# Altium schematic sheet ARM_EURO_Platine3.SchDoc
size A4; PageSetup: Record=PageOptions|CenterHorizontal=True|CenterVertical=True|PrintScale=1.00|XCorrection=1.00|YCorrection=1.00|PrintKind=0|BorderSize=5000000|LeftOffset=0|BottomOffset=0|Orientation=2|PaperLength=1000|PaperWidth=1000|Scale=100|PaperSource=7|PrintQuality=-3|MediaType=1|DitherType=10|PrintScaleMode=1|PaperKind=A4|PaperIndex=9
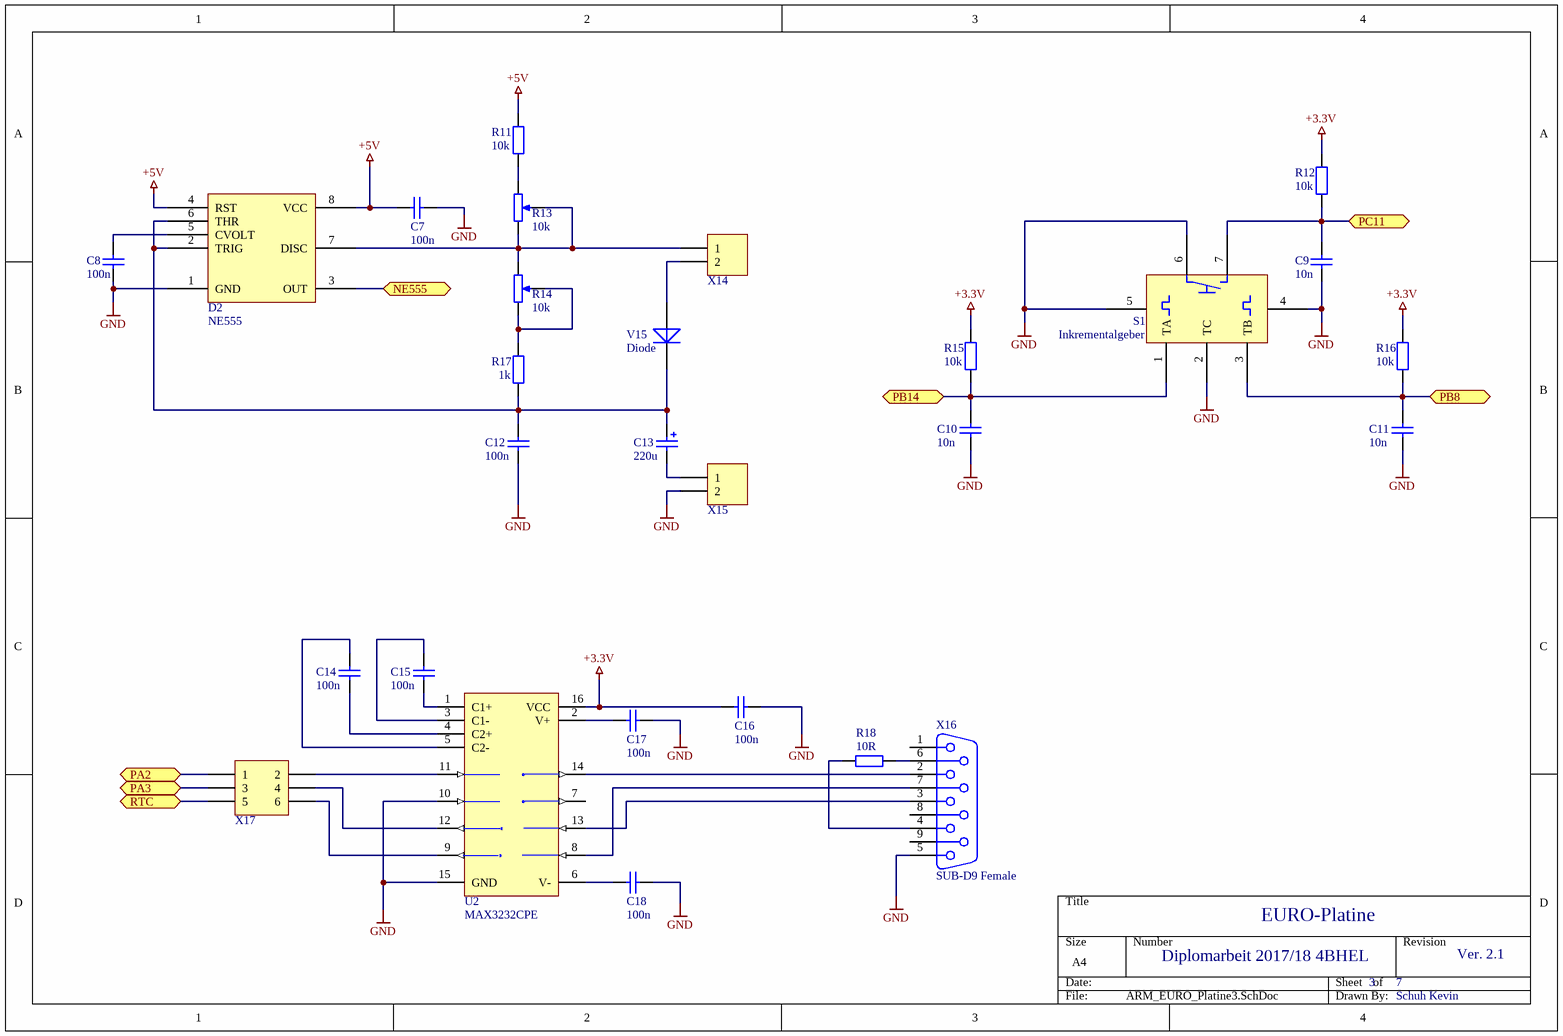
[diagram p0: ARM_EURO_Platine3.SchDoc]

## Parts
C7  value 100n  [0805_CAP]  (hidden comment: Cap_Keramik_SMD)
C8  value 100n  [0805_CAP]  (hidden comment: Cap_Keramik_SMD)
C9  value 10n  [0805_CAP]  (hidden comment: Cap_Keramik_SMD)
C10  value 10n  [0805_CAP]  (hidden comment: Cap_Keramik_SMD)
C11  value 10n  [0805_CAP]  (hidden comment: Cap_Keramik_SMD)
C12  value 100n  [0805_CAP]  (hidden comment: Cap_Keramik_SMD)
C13  value 220u  [100µF_16V_Kondensator]  (hidden comment: Cap_Pol_SMD)
C14  value 100n  [0805_CAP]  (hidden comment: Cap_Keramik_SMD)
C15  value 100n  [0805_CAP]  (hidden comment: Cap_Keramik_SMD)
C16  value 100n  [0805_CAP]  (hidden comment: Cap_Keramik_SMD)
C17  value 100n  [0805_CAP]  (hidden comment: Cap_Keramik_SMD)
C18  value 100n  [0805_CAP]  (hidden comment: Cap_Keramik_SMD)
D2  NE555  [PDIP8]
R11  value 10k  [0805_Res]  (hidden comment: Res_SMD)
R12  value 10k  [0805_Res]  (hidden comment: Res_SMD)
R13  value 10k  [Potentiometer]  (hidden comment: RPot)
R14  value 10k  [Potentiometer]  (hidden comment: RPot)
R15  value 10k  [0805_Res]  (hidden comment: Res_SMD)
R16  value 10k  [0805_Res]  (hidden comment: Res_SMD)
R17  value 1k  [0805_Res]  (hidden comment: Res_SMD)
R18  value 10R  [0805_Res]  (hidden comment: Res_SMD)
S1  Inkrementalgeber  [Inkrementalgeber]
U2  MAX3232CPE  [DIP_16]
V15  Diode  [Diode]
X14  Header  [HDR1X2]  (value not drawn)
X15  Header  [HDR1X2]  (value not drawn)
X16  SUB-D9 Female  [SUBD_9]
X17  Header_3x2  [HDR2X3]  (value not drawn)

## Ports
NE555, PA2, PA3, PB8, PB14, PC11, RTC

## Nets
+3.3V: C16.1 R12.1 R15.1 R16.1 U2.16(VCC)
+5V: C7.2 D2.4(RST) D2.8(VCC) R11.1
GND: C7.1 C8.2 C9.2 C10.2 C11.2 C12.2 C16.2 C17.2 C18.2 D2.1(GND) S1.2(TC) S1.4 S1.5 S1.6 U2.10(T2IN) U2.15(GND) X15.2 X16.5
NE555: D2.3(OUT) ; port NE555
PA2: X17.1 ; port PA2
PA3: X17.3 ; port PA3
PB8: C11.1 R16.2 S1.3(TB) ; port PB8
PB14: C10.1 R15.2 S1.1(TA) ; port PB14
PC11: C9.1 R12.2 S1.7 ; port PC11
RTC: X17.5 ; port RTC
NetC8_1: C8.1 D2.5(CVOLT)
NetC12_1: C12.1 C13.1 D2.2(TRIG) D2.6(THR) R17.2 V15.2(K)
NetC13_2: C13.2 X15.1
NetC14_1: C14.1 U2.4(C2+)
NetC14_2: C14.2 U2.5(C2-)
NetC15_1: C15.1 U2.1(C1+)
NetC15_2: C15.2 U2.3(C1-)
NetC17_1: C17.1 U2.2(V+)
NetC18_1: C18.1 U2.6(V-)
NetD2_7: D2.7(DISC) R13.2(BOT) R13.3(TAP) R14.1(TOP) X14.1
NetR11_2: R11.2 R13.1(TOP)
NetR14_2: R14.2(BOT) R14.3(TAP) R17.1
NetR18_1: R18.1 X16.4
NetR18_2: R18.2 X16.6
NetU2_8: U2.8(R2IN) X16.7
NetU2_9: U2.9(R2OUT) X17.6
NetU2_11: U2.11(T1IN) X17.2
NetU2_12: U2.12(R1OUT) X17.4
NetU2_13: U2.13(R1IN) X16.3
NetU2_14: U2.14(T1OUT) X16.2
NetV15_1: V15.1(A) X14.2

Not connected (* = marked no-connect by the designer): U2 7(T2OUT); X16 1 8 9

## Notes on the sheet
- EURO-Platine
- Diplomarbeit 2017/18 4BHEL
- 3
- 7
- Ver. 2.1
- Schuh Kevin

## Library data of the parts
C7-C12 C14-C18 = Cap_Keramik_SMD: Capacitor_SMD; Published: 8-Jun-2000; LatestRevisionDate: 17-Jul-2002; LatestRevisionNote: Re-released for DXP Platform.; PackageReference: RAD-0.3; Publisher: Altium Limited
C13 = Cap_Pol_SMD: Polarized Capacitor SMD; Published: 8-Jun-2000; LatestRevisionDate: 17-Jul-2002; LatestRevisionNote: Re-released for DXP Platform.; PackageReference: RB7.6-15; Publisher: Altium Limited
R11 R12 R15-R18 = Res_SMD: Resistor; Published: 8-Jun-2000; LatestRevisionDate: 17-Jul-2002; LatestRevisionNote: Re-released for DXP Platform.; PackageReference: AXIAL-0.4; Publisher: Altium Limited
R13 R14 = RPot: Potentiometer; Sim Note: Enter the Resistance value and the set point into parameter fields.; Set Position: 0.5; Published: 8-Jun-2000; LatestRevisionDate: 17-Jul-2002; LatestRevisionNote: Re-released for DXP Platform.; PackageReference: VR5; Publisher: Altium Limited
U2 = MAX3232CPE: 3.0V TO 5.5V, Low-Power, up to 1Mbps, True RS-232 Transceiver Using Four 0.1µF External Capacitor; Published: 16-Jan-2001; LatestRevisionDate: 06-Jun-2005; LatestRevisionNote: Stylized 3D Model Added.; DatasheetVersion: Mar-1999; PackageVersion: Aug-2000; PackageReference: PE16; Publisher: Altium Limited; PackageDescription: DIP; 16 Leads; Row Spacing 7.62 mm; Pitch 2.54 mm; Code_JEDEC: MS-001-BB; ComponentLink1Description: Manufacturer Link; ComponentLink1URL: http://www.maxim-ic.com/; ComponentLink2Description: Datasheet; ComponentLink2URL: http://pdfserv.maxim-ic.com/en/ds/MAX3222-MAX3241.pdf
V15 = Diode: Schottky Diode; Published: 8-Jun-2000; LatestRevisionDate: 17-Jul-2002; LatestRevisionNote: Re-released for DXP Platform.; PackageReference: SMB; Publisher: Altium Limited; Code_JEDEC: DO-214-AA
X14 X15 = Header_2: Header, 2-Pin; LatestRevisionDate: 17-Jul-2002; LatestRevisionNote: Re-released for DXP Platform.; Publisher: Altium Limited
X16 = SUB_D9: PackageDocument: O; Positions: 9; Gender: Receptacle; Published: 15-Jun-2001; LatestRevisionDate: 17-Jul-2002; LatestRevisionNote: Re-released for DXP Platform.; DatasheetDocument: 1-Sep-1999; PackageReference: 788750; Publisher: Altium Limited; Orientation: Right Angle
X17 = Header_3x2: Header, 3x2-Pin; LatestRevisionDate: 17-Jul-2002; LatestRevisionNote: Re-released for DXP Platform.; Publisher: Altium Limited